# Altium project Banker.PrjPCB (part 5 of 5)
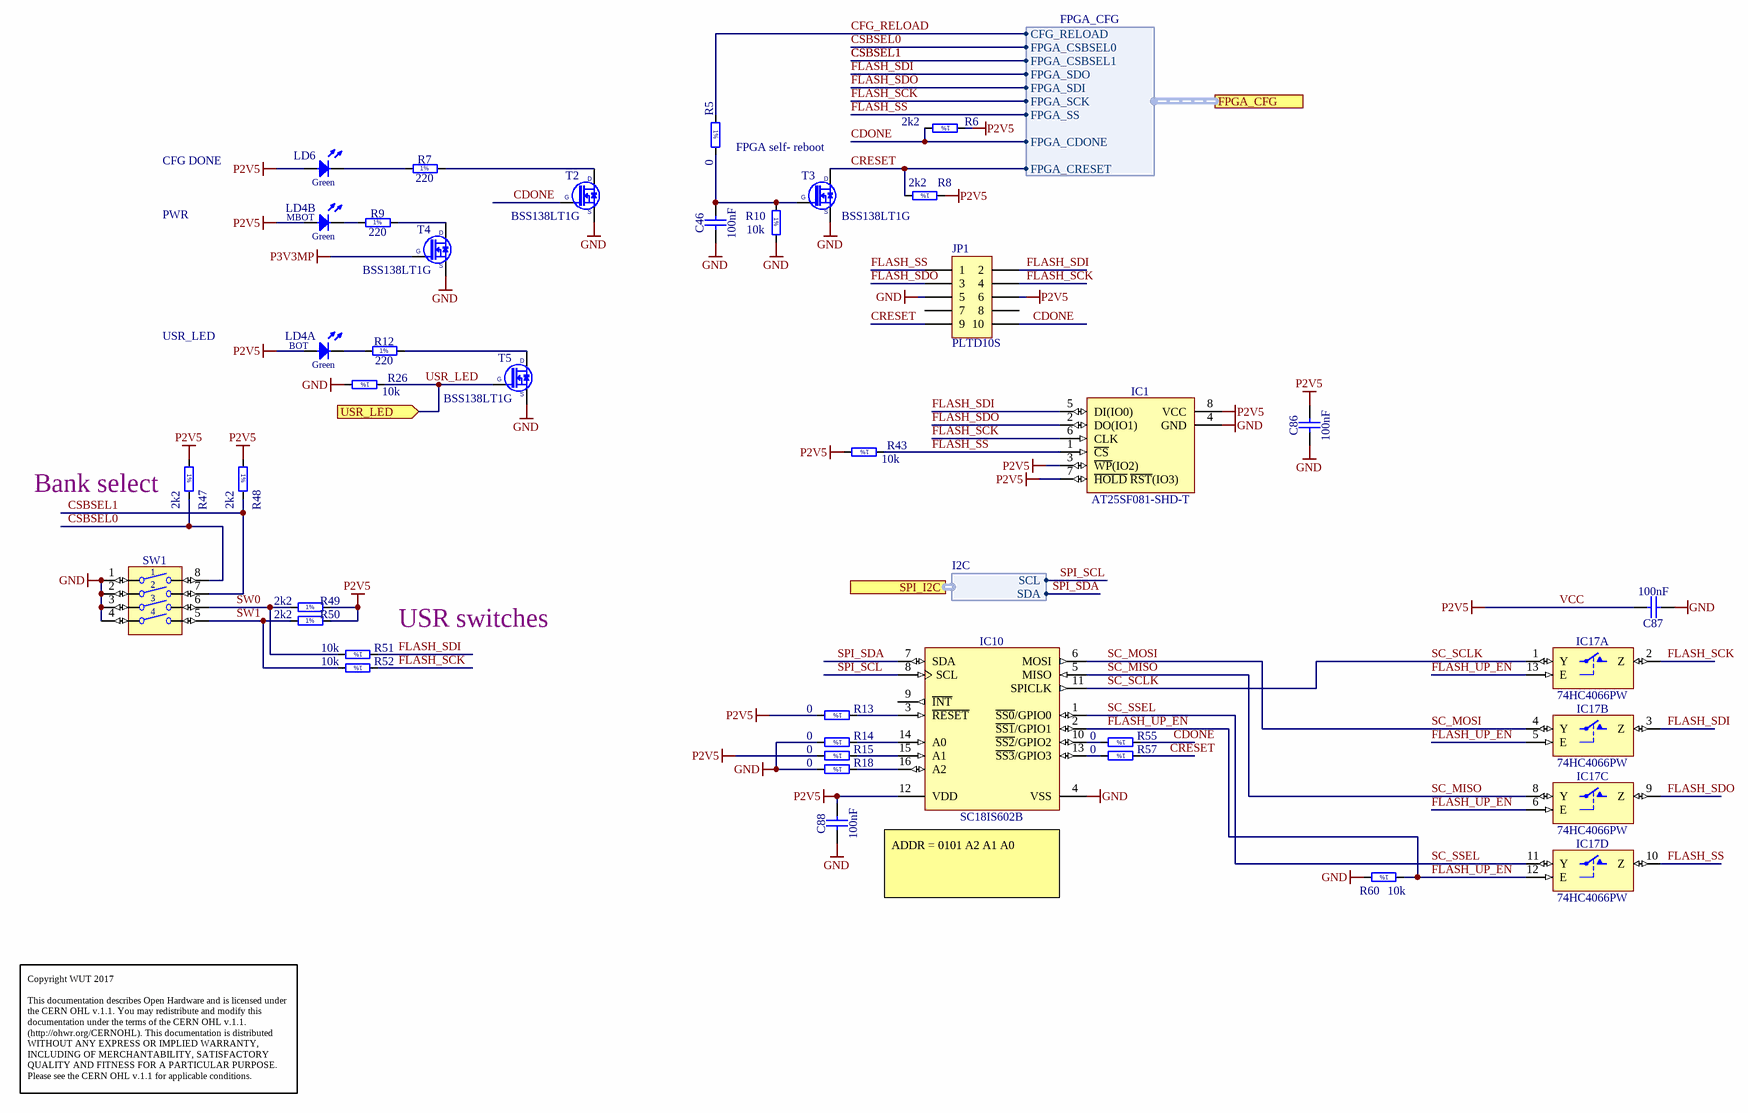
[diagram p108: FPGA_Config.SchDoc]

## Nets that join several sheets
GND: FPGA_LVDS (27 pins), VHDCI0_connector (98 pins), U_IDC_connectors0 (64 pins), VHDCI1_connector (98 pins), U_IDC_connectors1 (64 pins), U_IDC_connectors2 (64 pins), U_IDC_connectors3 (64 pins), FPGA (C85.1 OSC1.2), I2C_switch (17 pins), Supply (96 pins), FPGA_Config (21 pins)
P2V5: FPGA_LVDS (R65.2), VHDCI0_connector (10 pins), U_IDC_connectors0 (5 pins), VHDCI1_connector (10 pins), U_IDC_connectors1 (5 pins), U_IDC_connectors2 (5 pins), U_IDC_connectors3 (5 pins), FPGA (C85.2 OSC1.1 OSC1.4), Supply (41 pins), FPGA_Config (21 pins)
P3V3MP: FPGA_LVDS (J1.30 J2.30 J3.30), I2C_switch (30 pins), Supply (10 pins), FPGA_Config (T4.1)
P5V0: VHDCI0_connector (11 pins), U_IDC_connectors0 (5 pins), VHDCI1_connector (11 pins), U_IDC_connectors1 (5 pins), U_IDC_connectors2 (5 pins), U_IDC_connectors3 (5 pins), Supply (27 pins)
P12V0: FPGA_LVDS (6 pins), Supply (11 pins)
CDONE: FPGA (U1.M10), FPGA_Config (JP1.10 R6.2 R55.1 T2.1)
CFG_RELOAD: FPGA (U1.R16), FPGA_Config (R5.1)
CRESET: FPGA (U1.N11), FPGA_Config (JP1.9 R8.2 R57.1 T3.3)
CSBSEL0: FPGA (U1.K11), FPGA_Config (R47.2 SW1.8)
CSBSEL1: FPGA (U1.P13), FPGA_Config (R48.2 SW1.7)
DRV_OENn: FPGA_LVDS (R65.1 U1.F2), VHDCI0_connector (IC13.25 IC13.48 IC14.25 IC14.48), U_IDC_connectors0 (IC9A.25 IC9A.48), VHDCI1_connector (IC15.25 IC15.48 IC16.25 IC16.48), U_IDC_connectors1 (IC9B.25 IC9B.48), U_IDC_connectors2 (IC9C.25 IC9C.48), U_IDC_connectors3 (IC9D.25 IC9D.48)
EEM0_I2C_SCL: FPGA_LVDS (J1.27), I2C_switch (D1.3 IC6.11 R32.1)
EEM0_I2C_SDA: FPGA_LVDS (J1.26), I2C_switch (D1.2 IC6.10 R31.1)
EEM1_I2C_SCL: FPGA_LVDS (J2.27), I2C_switch (D2.3 IC6.8 R30.1)
EEM1_I2C_SDA: FPGA_LVDS (J2.26), I2C_switch (D2.2 IC6.7 R29.1)
EEM2_I2C_SCL: FPGA_LVDS (J3.27), I2C_switch (D4.3 IC6.13 R17.1 R233.1)
EEM2_I2C_SDA: FPGA_LVDS (J3.26), I2C_switch (D4.2 IC6.12 R16.1 R232.1)
FLASH_SCK: FPGA (U1.R11), FPGA_Config (IC1.6 IC17.2 JP1.4 R52.1)
FLASH_SDI: FPGA (U1.P12), FPGA_Config (IC1.5 IC17.3 JP1.2 R51.1)
FLASH_SDO: FPGA (U1.P11), FPGA_Config (IC1.2 IC17.9 JP1.3)
FLASH_SS: FPGA (U1.R12), FPGA_Config (IC1.1 IC17.10 JP1.1 R43.1)
FPGA_SCL: FPGA (U1.M12), I2C_switch (IC6.4 R174.1)
FPGA_SDA: FPGA (U1.T16), I2C_switch (IC6.3 R172.1)
IDC0_0_DIO0: U_IDC_connectors0 (RN1A.16), FPGA (U1.H16)
IDC0_0_DIO1: U_IDC_connectors0 (RN1A.15), FPGA (U1.F16)
IDC0_0_DIO2: U_IDC_connectors0 (RN1A.14), FPGA (U1.F15)
IDC0_0_DIO3: U_IDC_connectors0 (RN1A.13), FPGA (U1.E16)
IDC0_0_DIO4: U_IDC_connectors0 (RN1A.12), FPGA (U1.D16)
IDC0_0_DIO5: U_IDC_connectors0 (RN1A.11), FPGA (U1.G11)
IDC0_0_DIO6: U_IDC_connectors0 (RN1A.10), FPGA (U1.G13)
IDC0_0_DIO7: U_IDC_connectors0 (RN1A.9), FPGA (U1.G14)
IDC0_1_DIO0: U_IDC_connectors0 (RN2A.16), FPGA (U1.F13)
IDC0_1_DIO1: U_IDC_connectors0 (RN2A.15), FPGA (U1.G12)
IDC0_1_DIO2: U_IDC_connectors0 (RN2A.14), FPGA (U1.E14)
IDC0_1_DIO3: U_IDC_connectors0 (RN2A.13), FPGA (U1.D15)
IDC0_1_DIO4: U_IDC_connectors0 (RN2A.12), FPGA (U1.C16)
IDC0_1_DIO5: U_IDC_connectors0 (RN2A.11), FPGA (U1.F12)
IDC0_1_DIO6: U_IDC_connectors0 (RN2A.10), FPGA (U1.F11)
IDC0_1_DIO7: U_IDC_connectors0 (RN2A.9), FPGA (U1.B16)
IDC0_DIO0: U_IDC_connectors1 (RN1B.16), FPGA (U1.A16)
IDC0_DIO0: U_IDC_connectors2 (RN1C.16), FPGA (U1.C8)
IDC0_DIO0: U_IDC_connectors3 (RN1D.16), FPGA (U1.F7)
IDC0_DIO1: U_IDC_connectors1 (RN1B.15), FPGA (U1.B15)
IDC0_DIO1: U_IDC_connectors2 (RN1C.15), FPGA (U1.D10)
IDC0_DIO1: U_IDC_connectors3 (RN1D.15), FPGA (U1.D6)
IDC0_DIO2: U_IDC_connectors1 (RN1B.14), FPGA (U1.A15)
IDC0_DIO2: U_IDC_connectors2 (RN1C.14), FPGA (U1.E9)
IDC0_DIO2: U_IDC_connectors3 (RN1D.14), FPGA (U1.C5)
IDC0_DIO3: U_IDC_connectors1 (RN1B.13), FPGA (U1.B14)
IDC0_DIO3: U_IDC_connectors2 (RN1C.13), FPGA (U1.C9)
IDC0_DIO3: U_IDC_connectors3 (RN1D.13), FPGA (U1.E6)
IDC0_DIO4: U_IDC_connectors1 (RN1B.12), FPGA (U1.B13)
IDC0_DIO4: U_IDC_connectors2 (RN1C.12), FPGA (U1.D9)
IDC0_DIO4: U_IDC_connectors3 (RN1D.12), FPGA (U1.D5)
IDC0_DIO5: U_IDC_connectors1 (RN1B.11), FPGA (U1.C13)
IDC0_DIO5: U_IDC_connectors2 (RN1C.11), FPGA (U1.B9)
IDC0_DIO5: U_IDC_connectors3 (RN1D.11), FPGA (U1.E5)
IDC0_DIO6: U_IDC_connectors1 (RN1B.10), FPGA (U1.E11)
IDC0_DIO6: U_IDC_connectors2 (RN1C.10), FPGA (U1.A9)
IDC0_DIO6: U_IDC_connectors3 (RN1D.10), FPGA (U1.A5)
IDC0_DIO7: U_IDC_connectors1 (RN1B.9), FPGA (U1.D13)
IDC0_DIO7: U_IDC_connectors2 (RN1C.9), FPGA (U1.D8)
IDC0_DIO7: U_IDC_connectors3 (RN1D.9), FPGA (U1.B5)
IDC0_DIR: U_IDC_connectors0 (IC9A.1 R91A.2), FPGA (U1.G10)
IDC1_1_DIO0: U_IDC_connectors1 (RN2B.16), FPGA (U1.B12)
IDC1_1_DIO1: U_IDC_connectors1 (RN2B.15), FPGA (U1.B11)
IDC1_1_DIO2: U_IDC_connectors1 (RN2B.14), FPGA (U1.B10)
IDC1_1_DIO3: U_IDC_connectors1 (RN2B.13), FPGA (U1.A10)
IDC1_1_DIO4: U_IDC_connectors1 (RN2B.12), FPGA (U1.C12)
IDC1_1_DIO5: U_IDC_connectors1 (RN2B.11), FPGA (U1.D11)
IDC1_1_DIO6: U_IDC_connectors1 (RN2B.10), FPGA (U1.C11)
IDC1_1_DIO7: U_IDC_connectors1 (RN2B.9), FPGA (U1.C10)
IDC1_DIO0: U_IDC_connectors2 (RN2C.16), FPGA (U1.F9)
IDC1_DIO0: U_IDC_connectors3 (RN2D.16), FPGA (U1.B4)
IDC1_DIO1: U_IDC_connectors2 (RN2C.15), FPGA (U1.D7)
IDC1_DIO1: U_IDC_connectors3 (RN2D.15), FPGA (U1.C4)
IDC1_DIO2: U_IDC_connectors2 (RN2C.14), FPGA (U1.C7)
IDC1_DIO2: U_IDC_connectors3 (RN2D.14), FPGA (U1.A2)
IDC1_DIO3: U_IDC_connectors2 (RN2C.13), FPGA (U1.B8)
IDC1_DIO3: U_IDC_connectors3 (RN2D.13), FPGA (U1.B3)
IDC1_DIO4: U_IDC_connectors2 (RN2C.12), FPGA (U1.A7)
IDC1_DIO4: U_IDC_connectors3 (RN2D.12), FPGA (U1.A1)
IDC1_DIO5: U_IDC_connectors2 (RN2C.11), FPGA (U1.B7)
IDC1_DIO5: U_IDC_connectors3 (RN2D.11), FPGA (U1.C3)
IDC1_DIO6: U_IDC_connectors2 (RN2C.10), FPGA (U1.A6)
IDC1_DIO6: U_IDC_connectors3 (RN2D.10), FPGA (U1.D3)
IDC1_DIO7: U_IDC_connectors2 (RN2C.9), FPGA (U1.B6)
IDC1_DIO7: U_IDC_connectors3 (RN2D.9), FPGA (U1.D4)
IDC1_DIR: U_IDC_connectors0 (IC9A.24 R90A.2), FPGA (U1.F14)
IDC2_DIR: U_IDC_connectors1 (IC9B.1 R91B.2), FPGA (U1.C14)
IDC3_DIR: U_IDC_connectors1 (IC9B.24 R90B.2), FPGA (U1.E10)
IDC4_DIR: U_IDC_connectors2 (IC9C.1 R91C.2), FPGA (U1.A11)
IDC5_DIR: U_IDC_connectors2 (IC9C.24 R90C.2), FPGA (U1.C6)
IDC6_DIR: U_IDC_connectors3 (IC9D.1 R91D.2), FPGA (U1.E13)
IDC7_DIR: U_IDC_connectors3 (IC9D.24 R90D.2), FPGA (U1.D14)
NetR148_1: FPGA_LVDS (U1.B2), I2C_switch (R148.1 T1.1)
SPI_SCL: I2C_switch (IC6.6 R25.1), FPGA_Config (IC10.8)
SPI_SDA: I2C_switch (IC6.5 R24.1), FPGA_Config (IC10.7)
TEMP_SCL: I2C_switch (IC6.2 IC8.1 R42.1), Supply (R46.1)
TEMP_SDA: I2C_switch (IC6.1 IC8.3 R41.1), Supply (R45.1)
USR_LED: FPGA_LVDS (U1.H3), FPGA_Config (R26.1 T5.1)
VHDCI0_0-7_DIR: VHDCI0_connector (IC13.1 R134.2), FPGA (U1.T10)
VHDCI0_8-15_DIR: VHDCI0_connector (IC13.24 R133.2), FPGA (U1.T11)
VHDCI0_16-23_DIR: VHDCI0_connector (IC14.1 R168.2), FPGA (U1.T15)
VHDCI0_24-31_DIR: VHDCI0_connector (IC14.24 R167.2), FPGA (U1.T14)
VHDCI0_DIO0: VHDCI0_connector (RN3.16), FPGA (U1.H11)
VHDCI0_DIO1: VHDCI0_connector (RN3.15), FPGA (U1.G15)
VHDCI0_DIO2: VHDCI0_connector (RN3.14), FPGA (U1.G16)
VHDCI0_DIO3: VHDCI0_connector (RN3.13), FPGA (U1.H14)
VHDCI0_DIO4: VHDCI0_connector (RN3.12), FPGA (U1.H13)
VHDCI0_DIO5: VHDCI0_connector (RN3.11), FPGA (U1.H12)
VHDCI0_DIO6: VHDCI0_connector (RN3.10), FPGA (U1.J11)
VHDCI0_DIO7: VHDCI0_connector (RN3.9), FPGA (U1.J10)
VHDCI0_DIO8: VHDCI0_connector (RN4.16), FPGA (U1.J12)
VHDCI0_DIO9: VHDCI0_connector (RN4.15), FPGA (U1.J13)
VHDCI0_DIO10: VHDCI0_connector (RN4.14), FPGA (U1.J14)
VHDCI0_DIO11: VHDCI0_connector (RN4.13), FPGA (U1.J15)
VHDCI0_DIO12: VHDCI0_connector (RN4.12), FPGA (U1.J16)
VHDCI0_DIO13: VHDCI0_connector (RN4.11), FPGA (U1.K12)
VHDCI0_DIO14: VHDCI0_connector (RN4.10), FPGA (U1.K13)
VHDCI0_DIO15: VHDCI0_connector (RN4.9), FPGA (U1.K15)
VHDCI0_DIO16: VHDCI0_connector (RN5.16), FPGA (U1.K16)
VHDCI0_DIO17: VHDCI0_connector (RN5.15), FPGA (U1.K14)
VHDCI0_DIO18: VHDCI0_connector (RN5.14), FPGA (U1.L12)
VHDCI0_DIO19: VHDCI0_connector (RN5.13), FPGA (U1.L13)
VHDCI0_DIO20: VHDCI0_connector (RN5.12), FPGA (U1.L16)
VHDCI0_DIO21: VHDCI0_connector (RN5.11), FPGA (U1.L14)
VHDCI0_DIO22: VHDCI0_connector (RN5.10), FPGA (U1.M13)
VHDCI0_DIO23: VHDCI0_connector (RN5.9), FPGA (U1.M16)
VHDCI0_DIO24: VHDCI0_connector (RN6.16), FPGA (U1.M15)
VHDCI0_DIO25: VHDCI0_connector (RN6.15), FPGA (U1.M14)
VHDCI0_DIO26: VHDCI0_connector (RN6.14), FPGA (U1.N16)
VHDCI0_DIO27: VHDCI0_connector (RN6.13), FPGA (U1.P16)
VHDCI0_DIO28: VHDCI0_connector (RN6.12), FPGA (U1.P15)
VHDCI0_DIO29: VHDCI0_connector (RN6.11), FPGA (U1.P14)
VHDCI0_DIO30: VHDCI0_connector (RN6.10), FPGA (U1.R15)
VHDCI0_DIO31: VHDCI0_connector (RN6.9), FPGA (U1.R14)
VHDCI0_SCL: VHDCI0_connector (B9.1 J7.L17), I2C_switch (D3.3 IC6.15 R34.1)
VHDCI0_SDA: VHDCI0_connector (B10.1 J7.L51), I2C_switch (D3.2 IC6.14 R33.1)
VHDCI1_0-7_DIR: VHDCI1_connector (IC15.1 R202.2), FPGA (U1.M11)
VHDCI1_8-15_DIR: VHDCI1_connector (IC15.24 R201.2), FPGA (U1.T13)
VHDCI1_16-23_DIR: VHDCI1_connector (IC16.1 R236.2), FPGA (U1.N12)
VHDCI1_24-31_DIR: VHDCI1_connector (IC16.24 R235.2), FPGA (U1.L11)
VHDCI1_DIO0: VHDCI1_connector (RN7.16), FPGA (U1.R9)
VHDCI1_DIO1: VHDCI1_connector (RN7.15), FPGA (U1.T1)
VHDCI1_DIO2: VHDCI1_connector (RN7.14), FPGA (U1.R2)
VHDCI1_DIO3: VHDCI1_connector (RN7.13), FPGA (U1.T2)
VHDCI1_DIO4: VHDCI1_connector (RN7.12), FPGA (U1.R3)
VHDCI1_DIO5: VHDCI1_connector (RN7.11), FPGA (U1.T3)
VHDCI1_DIO6: VHDCI1_connector (RN7.10), FPGA (U1.R4)
VHDCI1_DIO7: VHDCI1_connector (RN7.9), FPGA (U1.R5)
VHDCI1_DIO8: VHDCI1_connector (RN8.16), FPGA (U1.P4)
VHDCI1_DIO9: VHDCI1_connector (RN8.15), FPGA (U1.N5)
VHDCI1_DIO10: VHDCI1_connector (RN8.14), FPGA (U1.T5)
VHDCI1_DIO11: VHDCI1_connector (RN8.13), FPGA (U1.P5)
VHDCI1_DIO12: VHDCI1_connector (RN8.12), FPGA (U1.R6)
VHDCI1_DIO13: VHDCI1_connector (RN8.11), FPGA (U1.T6)
VHDCI1_DIO14: VHDCI1_connector (RN8.10), FPGA (U1.N6)
VHDCI1_DIO15: VHDCI1_connector (RN8.9), FPGA (U1.P6)
VHDCI1_DIO16: VHDCI1_connector (RN9.16), FPGA (U1.T7)
VHDCI1_DIO17: VHDCI1_connector (RN9.15), FPGA (U1.T8)
VHDCI1_DIO18: VHDCI1_connector (RN9.14), FPGA (U1.N7)
VHDCI1_DIO19: VHDCI1_connector (RN9.13), FPGA (U1.P7)
VHDCI1_DIO20: VHDCI1_connector (RN9.12), FPGA (U1.M7)
VHDCI1_DIO21: VHDCI1_connector (RN9.11), FPGA (U1.P8)
VHDCI1_DIO22: VHDCI1_connector (RN9.10), FPGA (U1.N9)
VHDCI1_DIO23: VHDCI1_connector (RN9.9), FPGA (U1.P9)
VHDCI1_DIO24: VHDCI1_connector (RN10.16), FPGA (U1.T9)
VHDCI1_DIO25: VHDCI1_connector (RN10.15), FPGA (U1.L9)
VHDCI1_DIO26: VHDCI1_connector (RN10.14), FPGA (U1.L10)
VHDCI1_DIO27: VHDCI1_connector (RN10.13), FPGA (U1.R10)
VHDCI1_DIO28: VHDCI1_connector (RN10.12), FPGA (U1.N10)
VHDCI1_DIO29: VHDCI1_connector (RN10.11), FPGA (U1.P10)
VHDCI1_DIO30: VHDCI1_connector (RN10.10), FPGA (U1.M8)
VHDCI1_DIO31: VHDCI1_connector (RN10.9), FPGA (U1.M9)
VHDCI1_SCL: VHDCI1_connector (B11.1 J7.U17), I2C_switch (D5.3 IC6.17 R36.1)
VHDCI1_SDA: VHDCI1_connector (B12.1 J7.U51), I2C_switch (D5.2 IC6.16 R35.1)